# Altium schematic sheet 15_IO_USB.SchDoc
size A3; DocumentNumber: 15; SheetNumber: 15; SheetTotal: 21
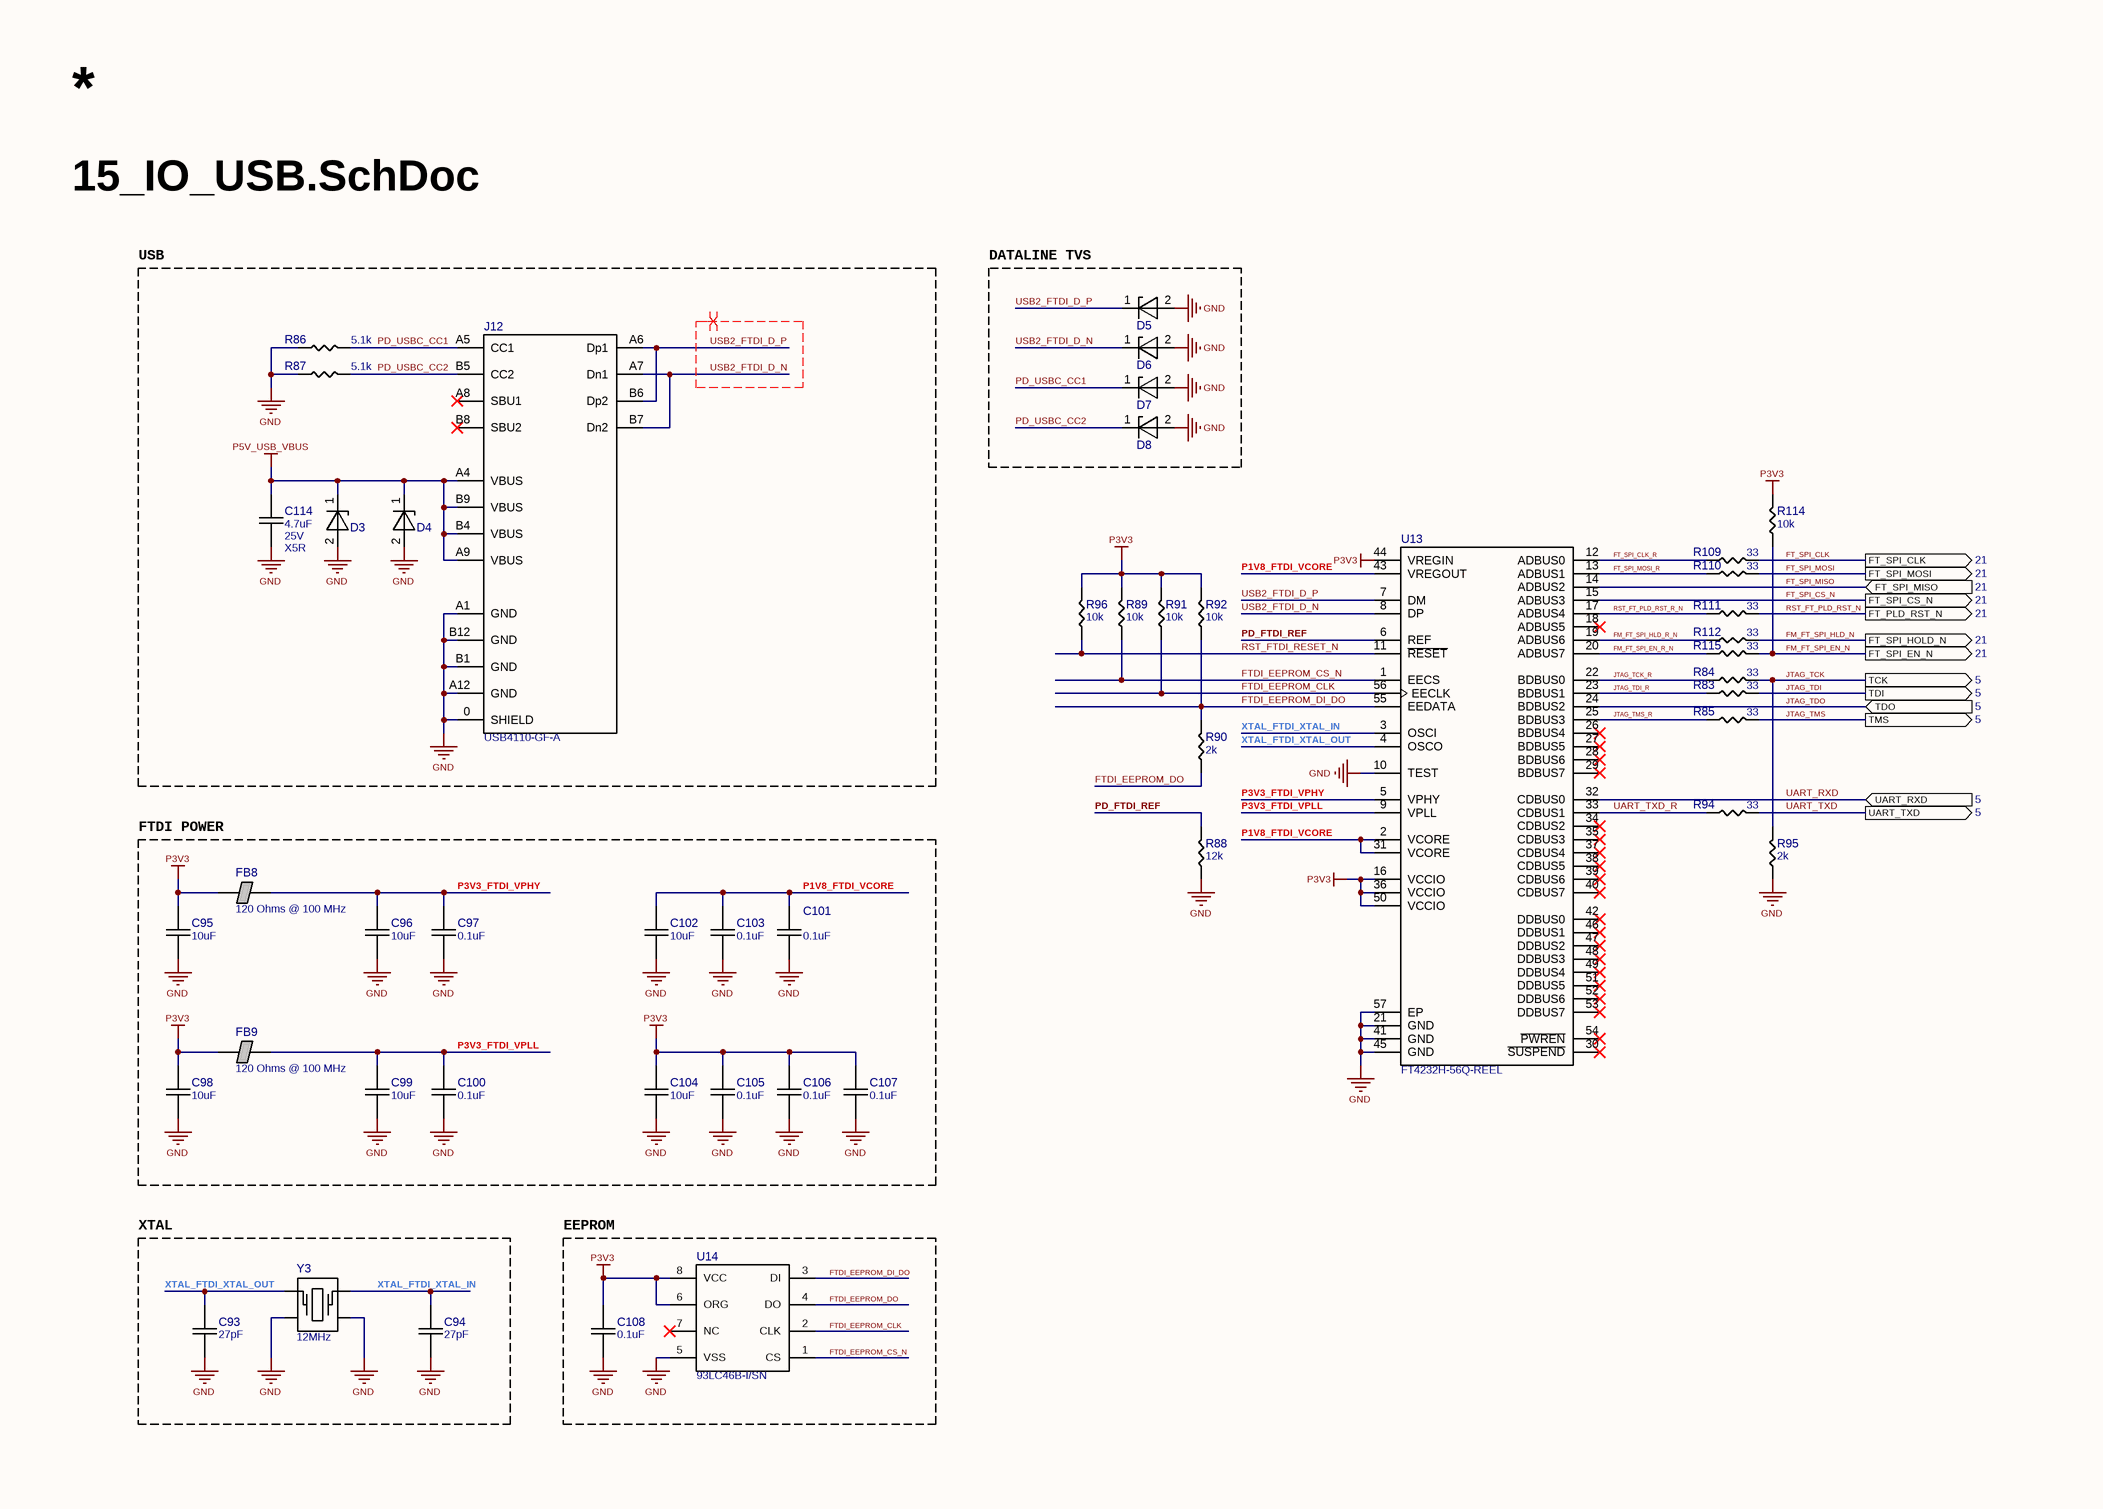
[diagram p0: 15_IO_USB.SchDoc]

## Parts
C93  27pF  [CAPC1005X06N]
C94  27pF  [CAPC1005X06N]
C95  10uF  [CAPC1005X06N]
C96  10uF  [CAPC1005X06N]
C97  0.1uF  [CAPC1005X06N]
C98  10uF  [CAPC1005X06N]
C99  10uF  [CAPC1005X06N]
C100  0.1uF  [CAPC1005X06N]
C101  0.1uF  [CAPC1005X06N]
C102  10uF  [CAPC1005X06N]
C103  0.1uF  [CAPC1005X06N]
C104  10uF  [CAPC1005X06N]
C105  0.1uF  [CAPC1005X06N]
C106  0.1uF  [CAPC1005X06N]
C107  0.1uF  [CAPC1005X06N]
C108  0.1uF  [CAPC1005X06N]
C114  4.7uF  Voltage: 25V  TempC: X5R  [CAPC1608X08N]
D3  ESD401DPYR  [DFN65P100X50-2N]  (value not drawn)
D4  ESD401DPYR  [DFN65P100X50-2N]  (value not drawn)
D5  ESD401DPYR  [DFN65P100X50-2N]  (value not drawn)
D6  ESD401DPYR  [DFN65P100X50-2N]  (value not drawn)
D7  ESD401DPYR  [DFN65P100X50-2N]  (value not drawn)
D8  ESD401DPYR  [DFN65P100X50-2N]  (value not drawn)
FB8  120 Ohms @ 100 MHz  [INDC1005X05N]
FB9  120 Ohms @ 100 MHz  [INDC1005X05N]
J12  USB4110-GF-A  [GCT_USB4110-GF-A]
R83  33  [RESC1005X03N]
R84  33  [RESC1005X03N]
R85  33  [RESC1005X03N]
R86  5.1k  [RESC1005X03N]
R87  5.1k  [RESC1005X03N]
R88  12k  [RESC1005X03N]
R89  10k  [RESC1005X03N]
R90  2k  [RESC1005X03N]
R91  10k  [RESC1005X03N]
R92  10k  [RESC1005X03N]
R94  33  [RESC1005X03N]
R95  2k  [RESC1005X03N]
R96  10k  [RESC1005X03N]
R109  33  [RESC1005X03N]
R110  33  [RESC1005X03N]
R111  33  [RESC1005X03N]
R112  33  [RESC1005X03N]
R114  10k  [RESC1005X03N]
R115  33  [RESC1005X03N]
U13  FT4232H-56Q-REEL  [QFN50P800X800X90_HS-57N]
U14  93LC46B-I/SN  [SOIC127P590X175-8N]
Y3  12MHz  [XTAL_3225]

## Blocks framed on the sheet
USB: C114 D3 D4 J12 R86 R87
DATALINE TVS: D5-D8
FTDI POWER: C95-C107 FB8 FB9
XTAL: C93 C94 Y3
EEPROM: C108 U14

## Ports
FT_PLD_RST_N (out, see 21), FT_SPI_CLK (out, see 21), FT_SPI_CS_N (out, see 21), FT_SPI_EN_N (out, see 21), FT_SPI_HOLD_N (out, see 21), FT_SPI_MISO (in, see 21), FT_SPI_MOSI (out, see 21), TCK (out, see 5), TDI (out, see 5), TDO (in, see 5), TMS (out, see 5), UART_RXD (in, see 5), UART_TXD (out, see 5)

## Nets
GND: C93.1 C94.1 C95.1 C96.1 C97.1 C98.1 C99.1 C100.1 C101.1 C102.1 C103.1 C104.1 C105.1 C106.1 C107.1 C108.1 C114.1 D3.2(A) D4.2(A) D5.2(A) D6.2(A) D7.2(A) D8.2(A) J12.0(SHIELD) J12.A1(GND) J12.A12(GND) J12.B1(GND) J12.B12(GND) R86.1 R87.1 R88.1 R95.1 U13.10(TEST) U13.21(GND) U13.41(GND) U13.45(GND) U13.57(EP) U14.5(VSS) Y3.2 Y3.4
P3V3: C95.2 C98.2 C104.2 C105.2 C106.2 C107.2 C108.2 FB8.1 FB9.1 R89.2 R91.2 R92.2 R96.2 R114.2 U13.16(VCCIO) U13.36(VCCIO) U13.44(VREGIN) U13.50(VCCIO) U14.6(ORG) U14.8(VCC)
P5V_USB_VBUS: C114.2 D3.1(C) D4.1(C) J12.A4(VBUS) J12.A9(VBUS) J12.B4(VBUS) J12.B9(VBUS)
FM_FT_SPI_EN_N: R114.1 R115.2 ; port FT_SPI_EN_N
FM_FT_SPI_EN_R_N: R115.1 U13.20(ADBUS7)
FM_FT_SPI_HLD_N: R112.2 ; port FT_SPI_HOLD_N
FM_FT_SPI_HLD_R_N: R112.1 U13.19(ADBUS6)
FT_SPI_CLK: R109.2 ; port FT_SPI_CLK
FT_SPI_CLK_R: R109.1 U13.12(ADBUS0)
FT_SPI_CS_N: U13.15(ADBUS3) ; port FT_SPI_CS_N
FT_SPI_MISO: U13.14(ADBUS2) ; port FT_SPI_MISO
FT_SPI_MOSI: R110.2 ; port FT_SPI_MOSI
FT_SPI_MOSI_R: R110.1 U13.13(ADBUS1)
FTDI_EEPROM_CLK: R91.1 U13.56(EECLK) U14.2(CLK)
FTDI_EEPROM_CS_N: R89.1 U13.1(EECS) U14.1(CS)
FTDI_EEPROM_DI_DO: R90.2 R92.1 U13.55(EEDATA) U14.3(DI)
FTDI_EEPROM_DO: R90.1 U14.4(DO)
JTAG_TCK: R84.2 R95.2 ; port TCK
JTAG_TCK_R: R84.1 U13.22(BDBUS0)
JTAG_TDI: R83.2 ; port TDI
JTAG_TDI_R: R83.1 U13.23(BDBUS1)
JTAG_TDO: U13.24(BDBUS2) ; port TDO
JTAG_TMS: R85.2 ; port TMS
JTAG_TMS_R: R85.1 U13.25(BDBUS3)
P1V8_FTDI_VCORE: C101.2 C102.2 C103.2 U13.2(VCORE) U13.31(VCORE) U13.43(VREGOUT)
P3V3_FTDI_VPHY: C96.2 C97.2 FB8.2 U13.5(VPHY)
P3V3_FTDI_VPLL: C99.2 C100.2 FB9.2 U13.9(VPLL)
PD_FTDI_REF: R88.2 U13.6(REF)
PD_USBC_CC1: D7.1(C) J12.A5(CC1) R86.2
PD_USBC_CC2: D8.1(C) J12.B5(CC2) R87.2
RST_FT_PLD_RST_N: R111.2 ; port FT_PLD_RST_N
RST_FT_PLD_RST_R_N: R111.1 U13.17(ADBUS4)
RST_FTDI_RESET_N: R96.1 U13.11(~{RESET})
UART_RXD: U13.32(CDBUS0) ; port UART_RXD
UART_TXD: R94.2 ; port UART_TXD
UART_TXD_R: R94.1 U13.33(CDBUS1)
USB2_FTDI_D_N: D6.1(C) J12.A7(Dn1) J12.B7(Dn2) U13.8(DP)
USB2_FTDI_D_P: D5.1(C) J12.A6(Dp1) J12.B6(Dp2) U13.7(DM)
XTAL_FTDI_XTAL_IN: C94.2 U13.3(OSCI) Y3.3
XTAL_FTDI_XTAL_OUT: C93.2 U13.4(OSCO) Y3.1

Not connected (* = marked no-connect by the designer): J12 A8(SBU1)* B8(SBU2)*; U13 18(ADBUS5)* 26(BDBUS4)* 27(BDBUS5)* 28(BDBUS6)* 29(BDBUS7)* 30(~{SUSPEND})* 34(CDBUS2)* 35(CDBUS3)* 37(CDBUS4)* 38(CDBUS5)* 39(CDBUS6)* 40(CDBUS7)* 42(DDBUS0)* 46(DDBUS1)* 47(DDBUS2)* 48(DDBUS3)* 49(DDBUS4)* 51(DDBUS5)* 52(DDBUS6)* 53(DDBUS7)* 54(~{PWREN})*; U14 7(NC)*

## Layout directives
differential pair; differential pair class 90D: USB2_FTDI_D_N, USB2_FTDI_D_P

## Library data of the parts
C93 C94 = CC0402JRNPO9BN270: CAP CER 27PF 50V C0G/NPO 0402; Manufacturer 1: Yageo; Tol: 5%; TempC: C0G/NP0; Part Number: CC0402JRNPO9BN270; Value: 27pF; Voltage: 50V; Manufacturer Part Number 1: CC0402JRNPO9BN270; Supplier 1: Digi-Key; Supplier Part Number 1: 311-1019-1-ND
C95 C96 C98 C99 C102 C104 = GRM155R60J106ME47D: CAP CER 10UF 6.3V X5R 0402; Manufacturer 1: Murata Electronics; Tol: 20%; Part Number: GRM155R60J106ME47D; Value: 10uF; Voltage: 6.3V; TempC: X5R; Manufacturer Part Number 1: GRM155R60J106ME47D; Supplier 1: Digi-Key; Supplier Part Number 1: 490-13239-1-ND
C97 C100 C101 C103 C105-C108 = GRM155R71E104KE14J: CAP CER 0.1UF 25V X7R 0402; Manufacturer 1: Murata Electronics; Tol: 10%; Part Number: GRM155R71E104KE14J; Value: 0.1uF; Voltage: 25V; TempC: X7R; Manufacturer Part Number 1: GRM155R71E104KE14J; Supplier 1: Digi-Key; Supplier Part Number 1: 490-14603-1-ND
C114 = GRM188R61E475KE11D: CAP CER 4.7UF 25V X5R 0603; Manufacturer 1: Murata Electronics; Tol: 10%; Part Number: GRM188R61E475KE11D; Value: 4.7uF; Manufacturer Part Number 1: GRM188R61E475KE11D; Supplier 1: Digi-Key; Supplier Part Number 1: 490-7203-1-ND
D3-D8 = ESD401DPYR: TVS DIODE 5.5V 24V 2X1SON; Manufacturer 1: Texas Instruments; Part Number: ESD401DPYR; Manufacturer Part Number 1: ESD401DPYR; Supplier 1: Digi-Key; Supplier Part Number 1: 296-47160-1-ND
FB8 FB9 = BLM15PD121SN1D: FERRITE BEAD 120 OHM 0402 1LN; Manufacturer 1: Murata Electronics; DCR: 90mOhm; Ir: 1.3A; Part Number: BLM15PD121SN1D; Value: 120 Ohms @ 100 MHz; Manufacturer Part Number 1: BLM15PD121SN1D; Supplier 1: Digi-Key; Supplier Part Number 1: 490-5203-1-ND
J12 = USB4110-GF-A: CONN RCP USB2.0 TYP C 24P SMD RA; Manufacturer 1: GCT; Part Number: USB4110-GF-A; Manufacturer Part Number 1: USB4110-GF-A; Supplier 1: Digi-Key; Supplier Part Number 1: 2073-USB4110-GF-A-1-ND
R83-R85 R94 R109-R112 R115 = RC0402FR-0733RL: RES SMD 33 OHM 1% 1/16W 0402; Manufacturer 1: Yageo; Part Number: RC0402FR-0733RL; Value: 33; Tol: 1%; Manufacturer Part Number 1: RC0402FR-0733RL; Supplier 1: Digi-Key; Supplier Part Number 1: 311-33.0LRCT-ND
R86 R87 = RC0402FR-075K1L: RES SMD 5.1K OHM 1% 1/16W 0402; Manufacturer 1: Yageo; Part Number: RC0402FR-075K1L; Value: 5.1k; Tol: 1%; Manufacturer Part Number 1: RC0402FR-075K1L; Supplier 1: Digi-Key; Supplier Part Number 1: 311-5.10KLRCT-ND
R88 = RC0402FR-0712KL: RES SMD 12K OHM 1% 1/16W 0402; Manufacturer 1: Yageo; Part Number: RC0402FR-0712KL; Value: 12k; Tol: 1%; Manufacturer Part Number 1: RC0402FR-0712KL; Supplier 1: Digi-Key; Supplier Part Number 1: 311-12.0KLRCT-ND
R89 R91 R92 R96 R114 = RC0402FR-0710KL: RES SMD 10K OHM 1% 1/16W 0402; Manufacturer 1: Yageo; Part Number: RC0402FR-0710KL; Value: 10k; Tol: 1%; Manufacturer Part Number 1: RC0402FR-0710KL; Supplier 1: Digi-Key; Supplier Part Number 1: 311-10.0KLRCT-ND
R90 R95 = RC0402FR-072KL: RES SMD 2K OHM 1% 1/16W 0402; Manufacturer 1: Yageo; Part Number: RC0402FR-072KL; Value: 2k; Tol: 1%; Manufacturer Part Number 1: RC0402FR-072KL; Supplier 1: Digi-Key; Supplier Part Number 1: 311-2KLRCT-ND
U13 = FT4232H-56Q-REEL: IC USB TO UART/MPSSE QUAD 56VQFN; Manufacturer 1: FTDI, Future Technology Devices International Ltd; Part Number: FT4232H-56Q-REEL; Manufacturer Part Number 1: FT4232H-56Q-REEL; Supplier 1: Digi-Key; Supplier Part Number 1: 768-1378-1-ND
U14 = 93LC46B-I/SN: IC EEPROM 1KBIT SPI 2MHZ 8SOIC; Manufacturer 1: Microchip Technology; Part Number: 93LC46B-I/SN; Manufacturer Part Number 1: 93LC46B-I/SN; Supplier 1: Digi-Key; Supplier Part Number 1: 93LC46B-I/SN-ND
Y3 = 7V-12.000MDDJ-T: CRYSTAL 12.0000MHZ 18PF SMD; Manufacturer 1: TXC CORPORATION; Part Number: 7V-12.000MDDJ-T; Value: 12MHz; Manufacturer Part Number 1: 7V-12.000MDDJ-T; Supplier 1: Digi-Key; Supplier Part Number 1: 887-7V-12.000MDDJ-TCT-ND